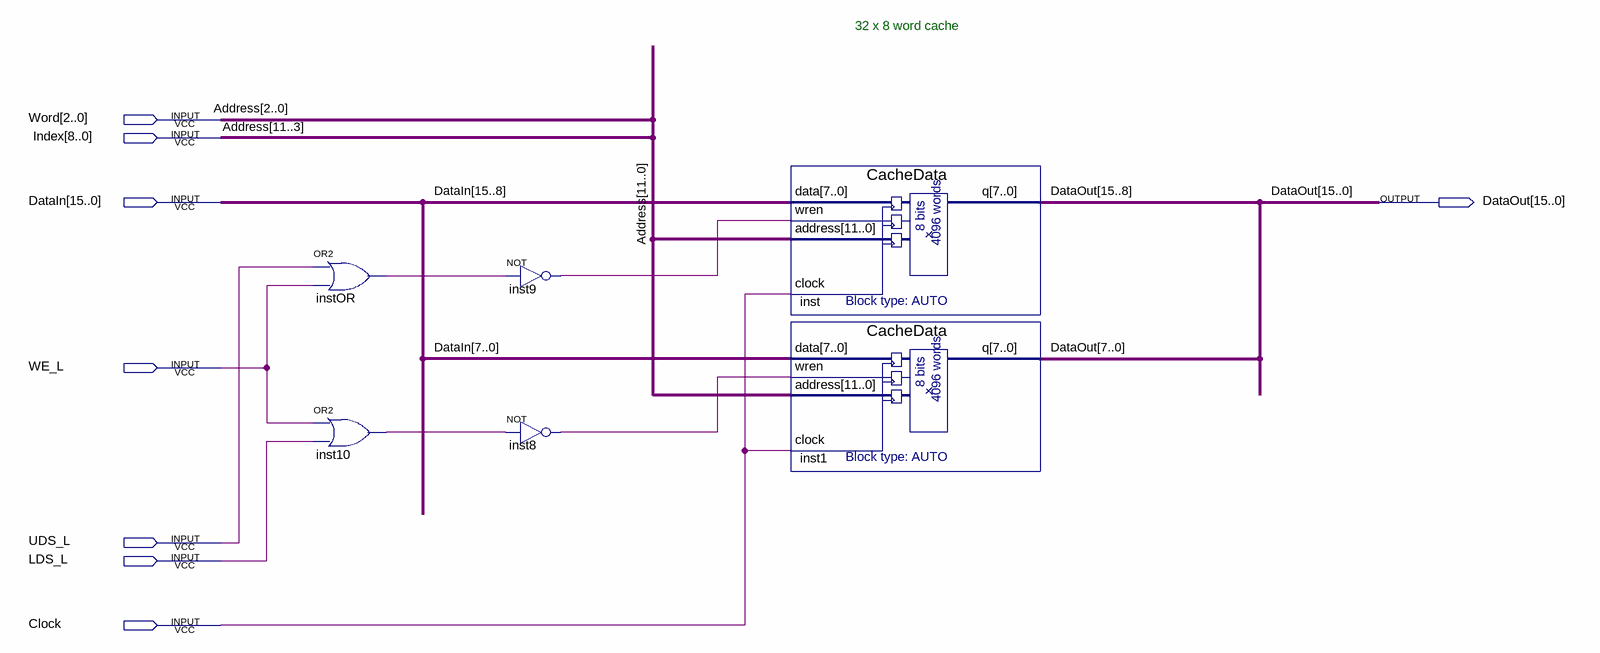
[diagram p0: schematic sheet]
// Quartus schematic CacheDataMemory.bdf as structural Verilog: 6 symbols, 8 pins
module CacheDataMemory (
  input  [2:0] Word,
  input  [8:0] Index,
  input  [15:0] DataIn,
  input  WE_L,
  input  UDS_L,
  input  LDS_L,
  input  Clock,
  output [15:0] DataOut
);

  wire inst8_out, inst9_out, inst10_out, instOR_out;

  or instOR (instOR_out, UDS_L, WE_L);
  or inst10 (inst10_out, WE_L, LDS_L);
  not inst9 (inst9_out, instOR_out);
  not inst8 (inst8_out, inst10_out);
  CacheData inst (.data(DataIn[15:8]), .wren(inst9_out), .address({Index, Word}), .clock(Clock), .q(DataOut[15:8]));
  CacheData inst1 (.data(DataIn[7:0]), .wren(inst8_out), .address({Index, Word}), .clock(Clock), .q(DataOut[7:0]));

  // Other names for the same wires on the sheet: Address[11:0] = {Index, Word}

  // Notes on the sheet:
  //   32 x 8 word cache
endmodule
